# Altium schematic sheet PS2_Regulators.SchDoc
size A3; SheetNumber: 2; SheetTotal: 20
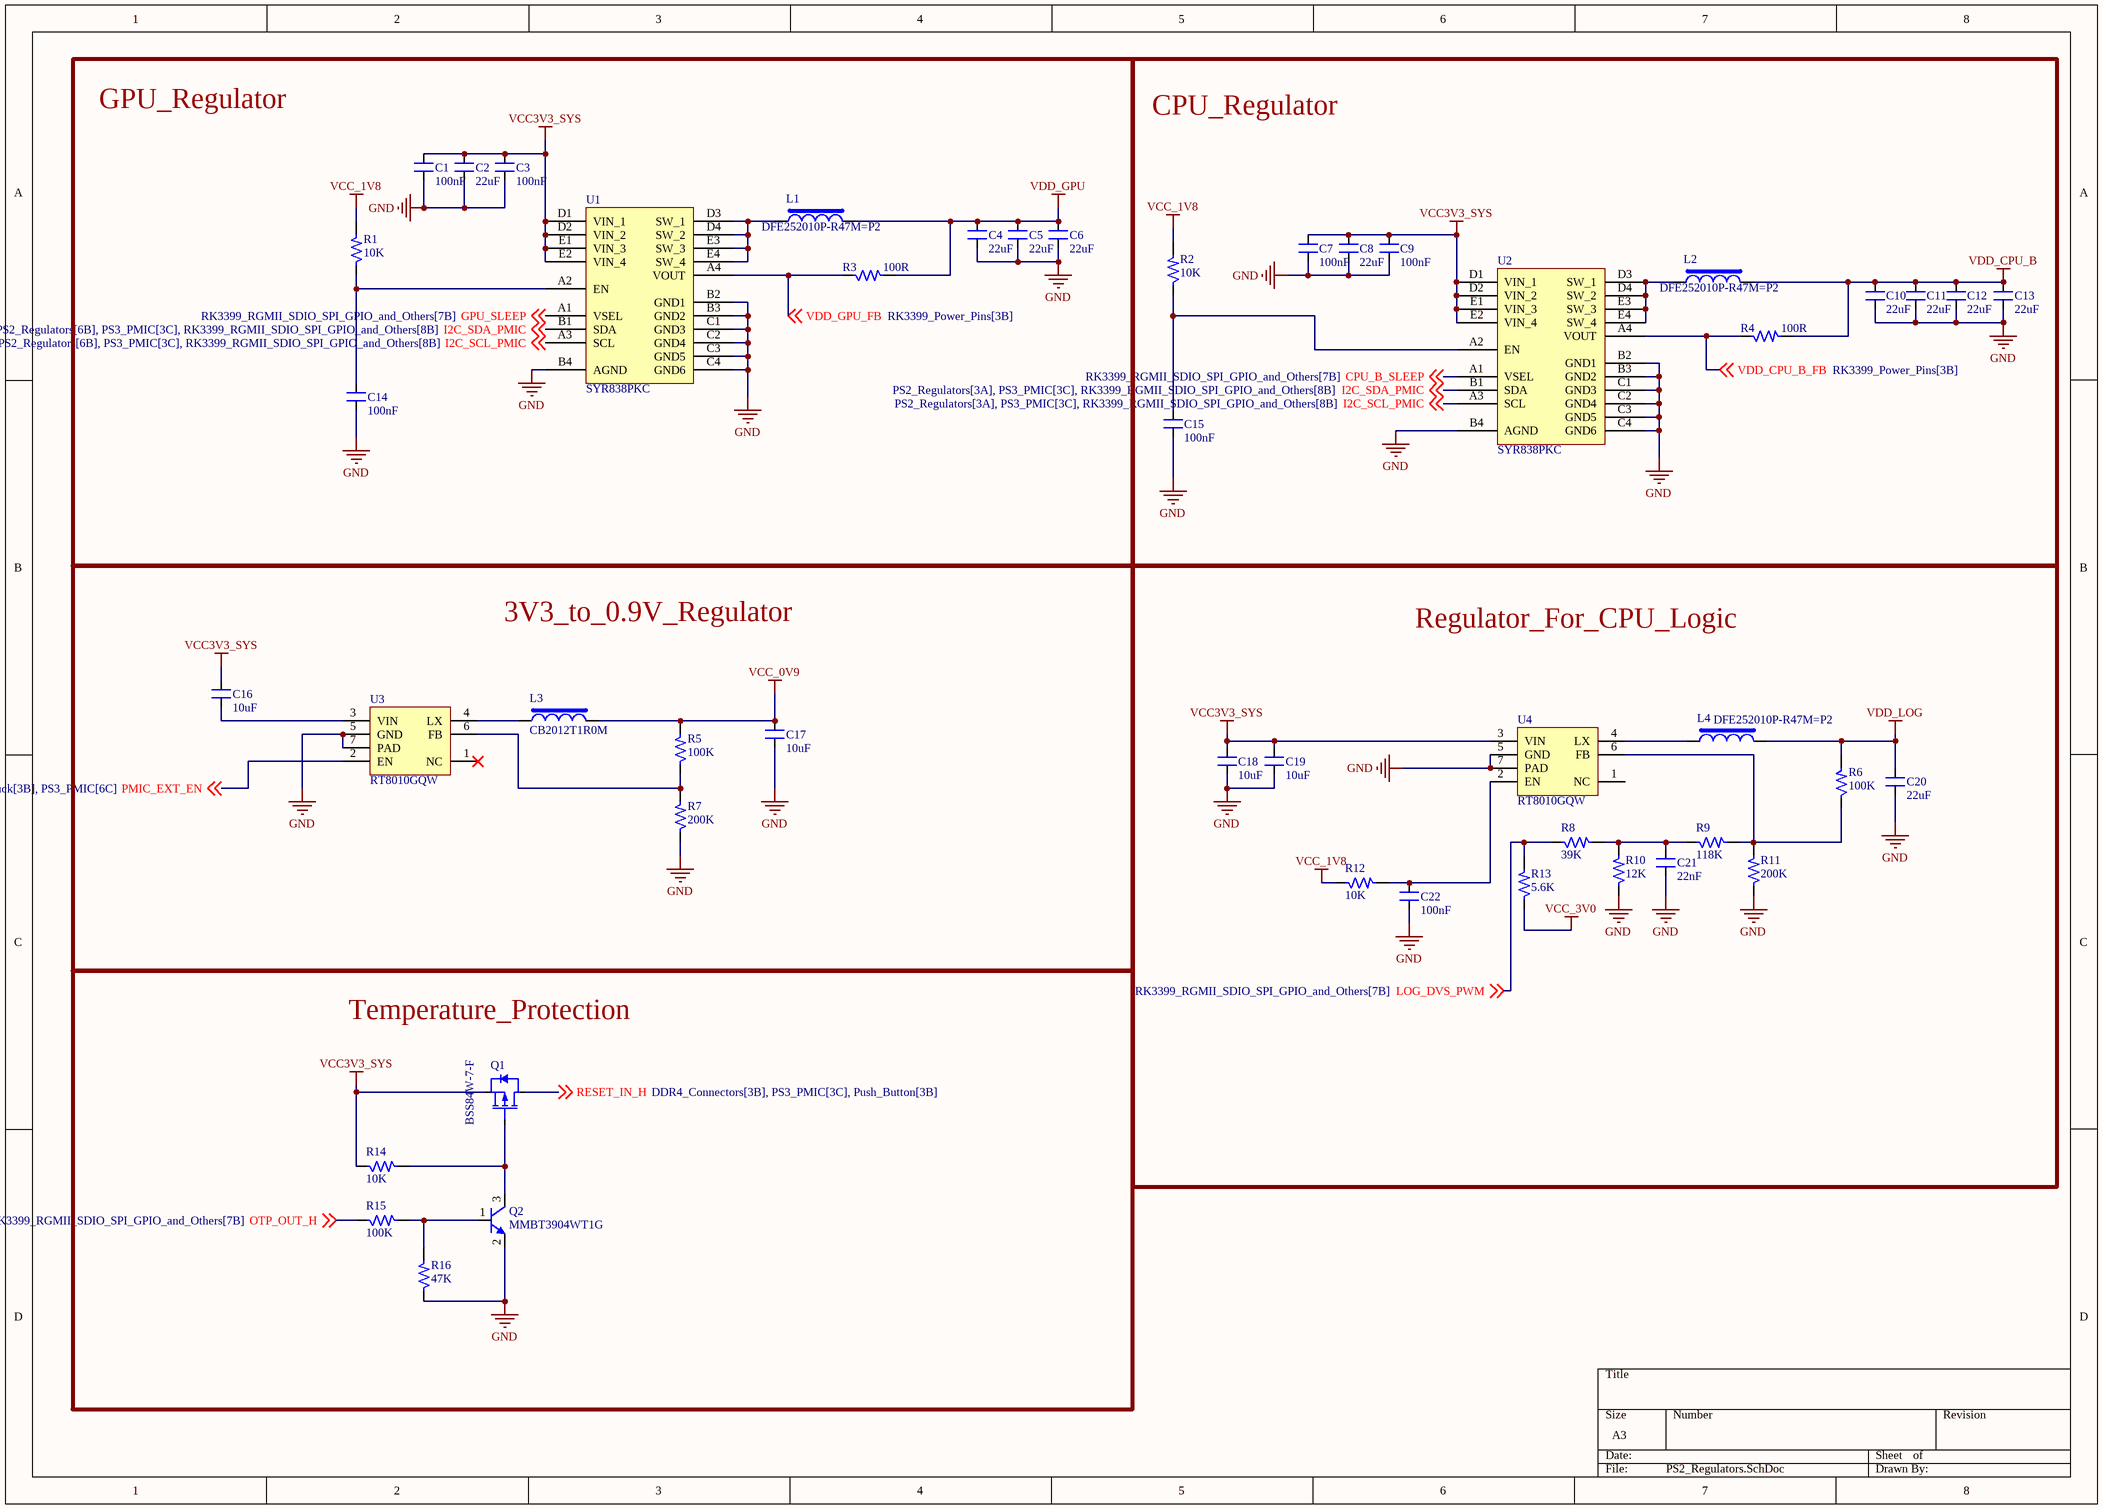
[diagram p0: PS2_Regulators.SchDoc]

## Parts
C1  100nF  [CAP_0402]
C2  22uF  [CAP_0603]
C3  100nF  [CAP_0402]
C4  22uF  [CAP_0603]
C5  22uF  [CAP_0603]
C6  22uF  [CAP_0603]
C7  100nF  [CAP_0402]
C8  22uF  [CAP_0603]
C9  100nF  [CAP_0402]
C10  22uF  [CAP_0603]
C11  22uF  [CAP_0603]
C12  22uF  [CAP_0603]
C13  22uF  [CAP_0603]
C14  100nF  [CAP_0402]
C15  100nF  [CAP_0402]
C16  10uF  [CAP_0402]
C17  10uF  [CAP_0402]
C18  10uF  [CAP_0402]
C19  10uF  [CAP_0402]
C20  22uF  [CAP_0603]
C21  22nF  [CAP_0402]
C22  100nF  [CAP_0402]
L1  DFE252010P-R47M=P2  [IND_1008]
L2  DFE252010P-R47M=P2  [IND_1008]
L3  CB2012T1R0M  [IND_0805]
L4  DFE252010P-R47M=P2  [IND_1008]
Q1  BSS84W-7-F  [SOT-323-3]
Q2  MMBT3904WT1G  [SOT-323-3]
R1  10K  [RES_0402]
R2  10K  [RES_0402]
R3  100R  [RES_0402]
R4  100R  [RES_0402]
R5  100K  [RES_0402]
R6  100K  [RES_0402]
R7  200K  [RES_0402]
R8  39K  [RES_0402]
R9  118K  [RES_0402]
R10  12K  [RES_0402]
R11  200K  [RES_0402]
R12  10K  [RES_0402]
R13  5.6K  [RES_0402]
R14  10K  [RES_0402]
R15  100K  [RES_0402]
R16  47K  [RES_0402]
U1  SYR838PKC  [CSP20_15.7_100x84_SMD]
U2  SYR838PKC  [CSP20_15.7_100x84_SMD]
U3  RT8010GQW  [WDFN-6_26_133X100_SMD]
U4  RT8010GQW  [WDFN-6_26_133X100_SMD]

## Blocks framed on the sheet
GPU_Regulator: C1-C6 C14 L1 R1 R3 U1
CPU_Regulator: C7-C13 C15 L2 R2 R4 U2
3V3_to_0.9V_Regulator: C16 C17 L3 R5 R7 U3
Regulator_For_CPU_Logic: C18-C22 L4 R6 R8-R13 U4
Temperature_Protection: Q1 Q2 R14-R16

## Nets
GND: C1.1 C2.1 C3.1 C4.1 C5.1 C6.1 C7.1 C8.1 C9.1 C10.1 C11.1 C12.1 C13.1 C14.1 C15.1 C17.1 C18.1 C19.1 C20.1 C21.1 C22.1 Q2.2(E) R7.1 R10.1 R11.1 R16.1 U1.B2(GND1) U1.B3(GND2) U1.B4(AGND) U1.C1(GND3) U1.C2(GND4) U1.C3(GND5) U1.C4(GND6) U2.B2(GND1) U2.B3(GND2) U2.B4(AGND) U2.C1(GND3) U2.C2(GND4) U2.C3(GND5) U2.C4(GND6) U3.5(GND) U3.7(PAD) U4.5(GND) U4.7(PAD)
VCC3V3_SYS: C1.2 C2.2 C3.2 C7.2 C8.2 C9.2 C16.2 C18.2 C19.2 Q1.2(S) R14.1 U1.D1(VIN_1) U1.D2(VIN_2) U1.E1(VIN_3) U1.E2(VIN_4) U2.D1(VIN_1) U2.D2(VIN_2) U2.E1(VIN_3) U2.E2(VIN_4) U4.3(VIN)
VCC_0V9: C17.2 L3.2 R5.2
VCC_1V8: R1.2 R2.2 R12.1
VCC_3V0: R13.1
VDD_CPU_B: C10.2 C11.2 C12.2 C13.2 L2.2 R4.2
VDD_GPU: C4.2 C5.2 C6.2 L1.2 R3.2
VDD_LOG: C20.2 L4.2 R6.2
CPU_B_SLEEP: U2.A1(VSEL) ; off-sheet CPU_B_SLEEP
GPU_SLEEP: U1.A1(VSEL) ; off-sheet GPU_SLEEP
I2C_SCL_PMIC: U1.A3(SCL) U2.A3(SCL) ; off-sheet I2C_SCL_PMIC
I2C_SDA_PMIC: U1.B1(SDA) U2.B1(SDA) ; off-sheet I2C_SDA_PMIC
LOG_DVS_PWM: R8.1 R13.2 ; off-sheet LOG_DVS_PWM
OTP_OUT_H: R15.1 ; off-sheet OTP_OUT_H
PMIC_EXT_EN: U3.2(EN) ; off-sheet PMIC_EXT_EN
RESET_IN_H: Q1.3(D) ; off-sheet RESET_IN_H
VDD_CPU_B_FB: R4.1 U2.A4(VOUT) ; off-sheet VDD_CPU_B_FB
VDD_GPU_FB: R3.1 U1.A4(VOUT) ; off-sheet VDD_GPU_FB
NetC14_2: C14.2 R1.1 U1.A2(EN)
NetC15_2: C15.2 R2.1 U2.A2(EN)
NetC16_1: C16.1 U3.3(VIN)
NetC21_2: C21.2 R8.2 R9.1 R10.2
NetC22_2: C22.2 R12.2 U4.2(EN)
NetL1_1: L1.1 U1.D3(SW_1) U1.D4(SW_2) U1.E3(SW_3) U1.E4(SW_4)
NetL2_1: L2.1 U2.D3(SW_1) U2.D4(SW_2) U2.E3(SW_3) U2.E4(SW_4)
NetL3_1: L3.1 U3.4(LX)
NetL4_1: L4.1 U4.4(LX)
NetQ1_1: Q1.1(G) Q2.3(C) R14.2
NetQ2_1: Q2.1(B) R15.2 R16.2
NetR5_1: R5.1 R7.2 U3.6(FB)
NetR6_1: R6.1 R9.2 R11.2 U4.6(FB)

Not connected (* = marked no-connect by the designer): U3 1(NC)*; U4 1(NC)

## Library data of the parts
C1 C3 C7 C9 C14 C15 C22 = CAP_100nF-25V-10%-0402: 0.1µF ±10% 25V Ceramic Capacitor X7R 0402 (1005 Metric); Manufacturer: Walsin Technology Corporation; Manufacturer Part Number: 0402B104K250CT; Case/Package: 0402; Supplier-1: Digikey
C2 C4-C6 C8 C10-C13 C20 = CAP_22uF-10V-20%-0603: 22µF ±20% 10V Ceramic Capacitor X5R 0603 (1608 Metric); Manufacturer: Murata Electronics; Manufacturer Part Number: GRM188R61A226ME15D; Case/Package: 0603; Supplier-1: Digikey
C16-C19 = CAP_10uF-10V-20%-0402: 10µF ±20% 10V Ceramic Capacitor X5R 0402 (1005 Metric); Manufacturer Part Number: CL05A106MP5NUNC; Manufacturer: Samsung Electro-Mechanics; Case/Package: 0402; Supplier-1: Digikey
C21 = CAP_22nF-10V-10%-0402: 0.022µF ±10% 10V Ceramic Capacitor X7R 0402 (1005 Metric); Manufacturer: Samsung Electro-Mechanics; Manufacturer Part Number: CL05B223KP5NNNC; Case/Package: 0402; Supplier-1: Digikey
L1 L2 L4 = IND_470nH-5A-20%-1008: 470nH Shielded Wirewound Inductor 5A 35mOhm Max 1008 (2520 Metric); Manufacturer: Murata Electronics; Manufacturer Part Number: DFE252010P-R47M=P2; Case/Package: 1008; Supplier-1: Digikey
L3 = IND_1uF-0.5A-20%-0805: 1uH ±20% 500mA 150mΩ 0805 Inductors (SMD) RoHS; Manufacturer: Taiyo Yuden; Manufacturer Part Number: CB2012T1R0M; Case/Package: 0805; Supplier-1: LCSC
Q1 = MOSFET-P_50V-130mA-SOT-323: P-Channel 50V 130mA (Ta) 200mW (Ta) Surface Mount SOT-323; Manufacturer: Diodes Incorporated; Manufacturer Part Number: BSS84W-7-F; Case/Package: SOT-323; Supplier-1: Digikey
Q2 = TRNS-NPN_60V-0.2A-SOT323: Bipolar Transistors - BJT 200mA 60V NPN; Manufacturer: ON Semiconductor; Manufacturer Part Number: MMBT3904WT1G; Case/Package: SOT323; Supplier-1: Digikey
R1 R2 R12 R14 = RES_10K-0.1W-1%-0402: 10 kOhms ±1% 0.1W, 1/10W Chip Resistor 0402 (1005 Metric) Anti-Sulfur Thin Film; Manufacturer: Vishay Beyschlag/Draloric/BC Components; Manufacturer Part Number: MCS04020C1002FE000; Case/Package: 0402; Supplier-1: Digikey
R3 R4 = RES_100R-0.1W-1%-0402: 100 Ohms ±1% 0.1W, 1/10W Chip Resistor 0402 (1005 Metric) Automotive AEC-Q200, Moisture Resistant Thick Film; Manufacturer: KOA Speer Electronics, Inc.; Manufacturer Part Number: RK73H1ETTP1000F; Case/Package: 0402; Supplier-1: Digikey
R5 R6 R15 = RES_100K-0.1W-1%-0402: 100 kOhms ±1% 0.1W, 1/10W Chip Resistor 0402 (1005 Metric) Anti-Sulfur Thin Film; Manufacturer: Vishay Beyschlag/Draloric/BC Components; Manufacturer Part Number: MCS04020C1003FE000; Case/Package: 0402; Supplier-1: Digikey
R7 R11 = RES_200K-0.1W-1%-0402: 200 kOhms ±1% 0.1W, 1/10W Chip Resistor 0402 (1005 Metric) Automotive AEC-Q200 Thick Film; Manufacturer: Panasonic Electronic Components; Manufacturer Part number: ERJ-2RKF2003X; Case/Package: 0402; Supplier-1: Digikey
R8 = RES_39K-0.1W-1%-0402: 39 kOhms ±1% 0.1W, 1/10W Chip Resistor 0402 (1005 Metric) Automotive AEC-Q200, Moisture Resistant Thick Film; Manufacturer: KOA Speer Electronics, Inc.; Manufacturer Part Number: RK73H1ETTP3902F; Case/Package: 0402; Supplier-1: Digikey
R9 = RES_118K-0.1W-1%-0402: 118 kOhms ±1% 0.1W, 1/10W Chip Resistor 0402 (1005 Metric) Automotive AEC-Q200, Moisture Resistant Thick Film; Manufacturer: KOA Speer Electronics, Inc.; Manuafcturer Part Number: RK73H1ETTP1183F; Case/Package: 0402; Supplier-1: Digikey
R10 = RES_12K-0.1W-1%-0402: 12 kOhms ±1% 0.1W, 1/10W Chip Resistor 0402 (1005 Metric) Anti-Sulfur Thin Film; Manufacturer: Vishay Beyschlag/Draloric/BC Components; Manufacturer Part Number: MCS04020C1202FE000; Case/Package: 0402; Supplier-1: Digikey
R13 = RES_5.6K-0.1W-1%-0402: 5.6 kOhms ±1% 0.1W, 1/10W Chip Resistor 0402 (1005 Metric) Automotive AEC-Q200, Moisture Resistant Thick Film; Manufacturer: KOA Speer Electronics, Inc.; Manufacturer Part Number: RK73H1ETTP5601F; Case/Package: 0402; Supplier-1: Digikey
R16 = RES_47K-0.1W-1%-0402: 47 kOhms ±1% 0.1W, 1/10W Chip Resistor 0402 (1005 Metric) Automotive AEC-Q200 Thick Film; Manufacturer: Panasonic Electronic Components; Manufacturer Part Number: ERJ-2RKF4702X; Case/Package: 0402; Supplier-1: Digikey
U1 U2 = IC_SYR838PKC: Step-Down Positive Programmable 1 6A 2.4MHz CSP1.56*1.96-20 DC-DC Converters RoHS; Manufacturer: Silergy Corp; Manufacturer Part Number: SYR838PKC; Case/Package: CSP1.56*1.96-20; Supplier-1: LCSC
U3 U4 = REG-ADJ_5.5V-5.5V-1A-6-WDFN: Buck Switching Regulator IC Positive Adjustable 0.6V 1 Output 1A 6-WDFN Exposed Pad; Manufacturer: Richtek USA Inc.; Manufacturer Part Number: RT8010GQW; Case/Package: 6-WDFN; Supplier-1: Digikey